# EAGLE schematic triple8_2 (EAGLE 5.06)
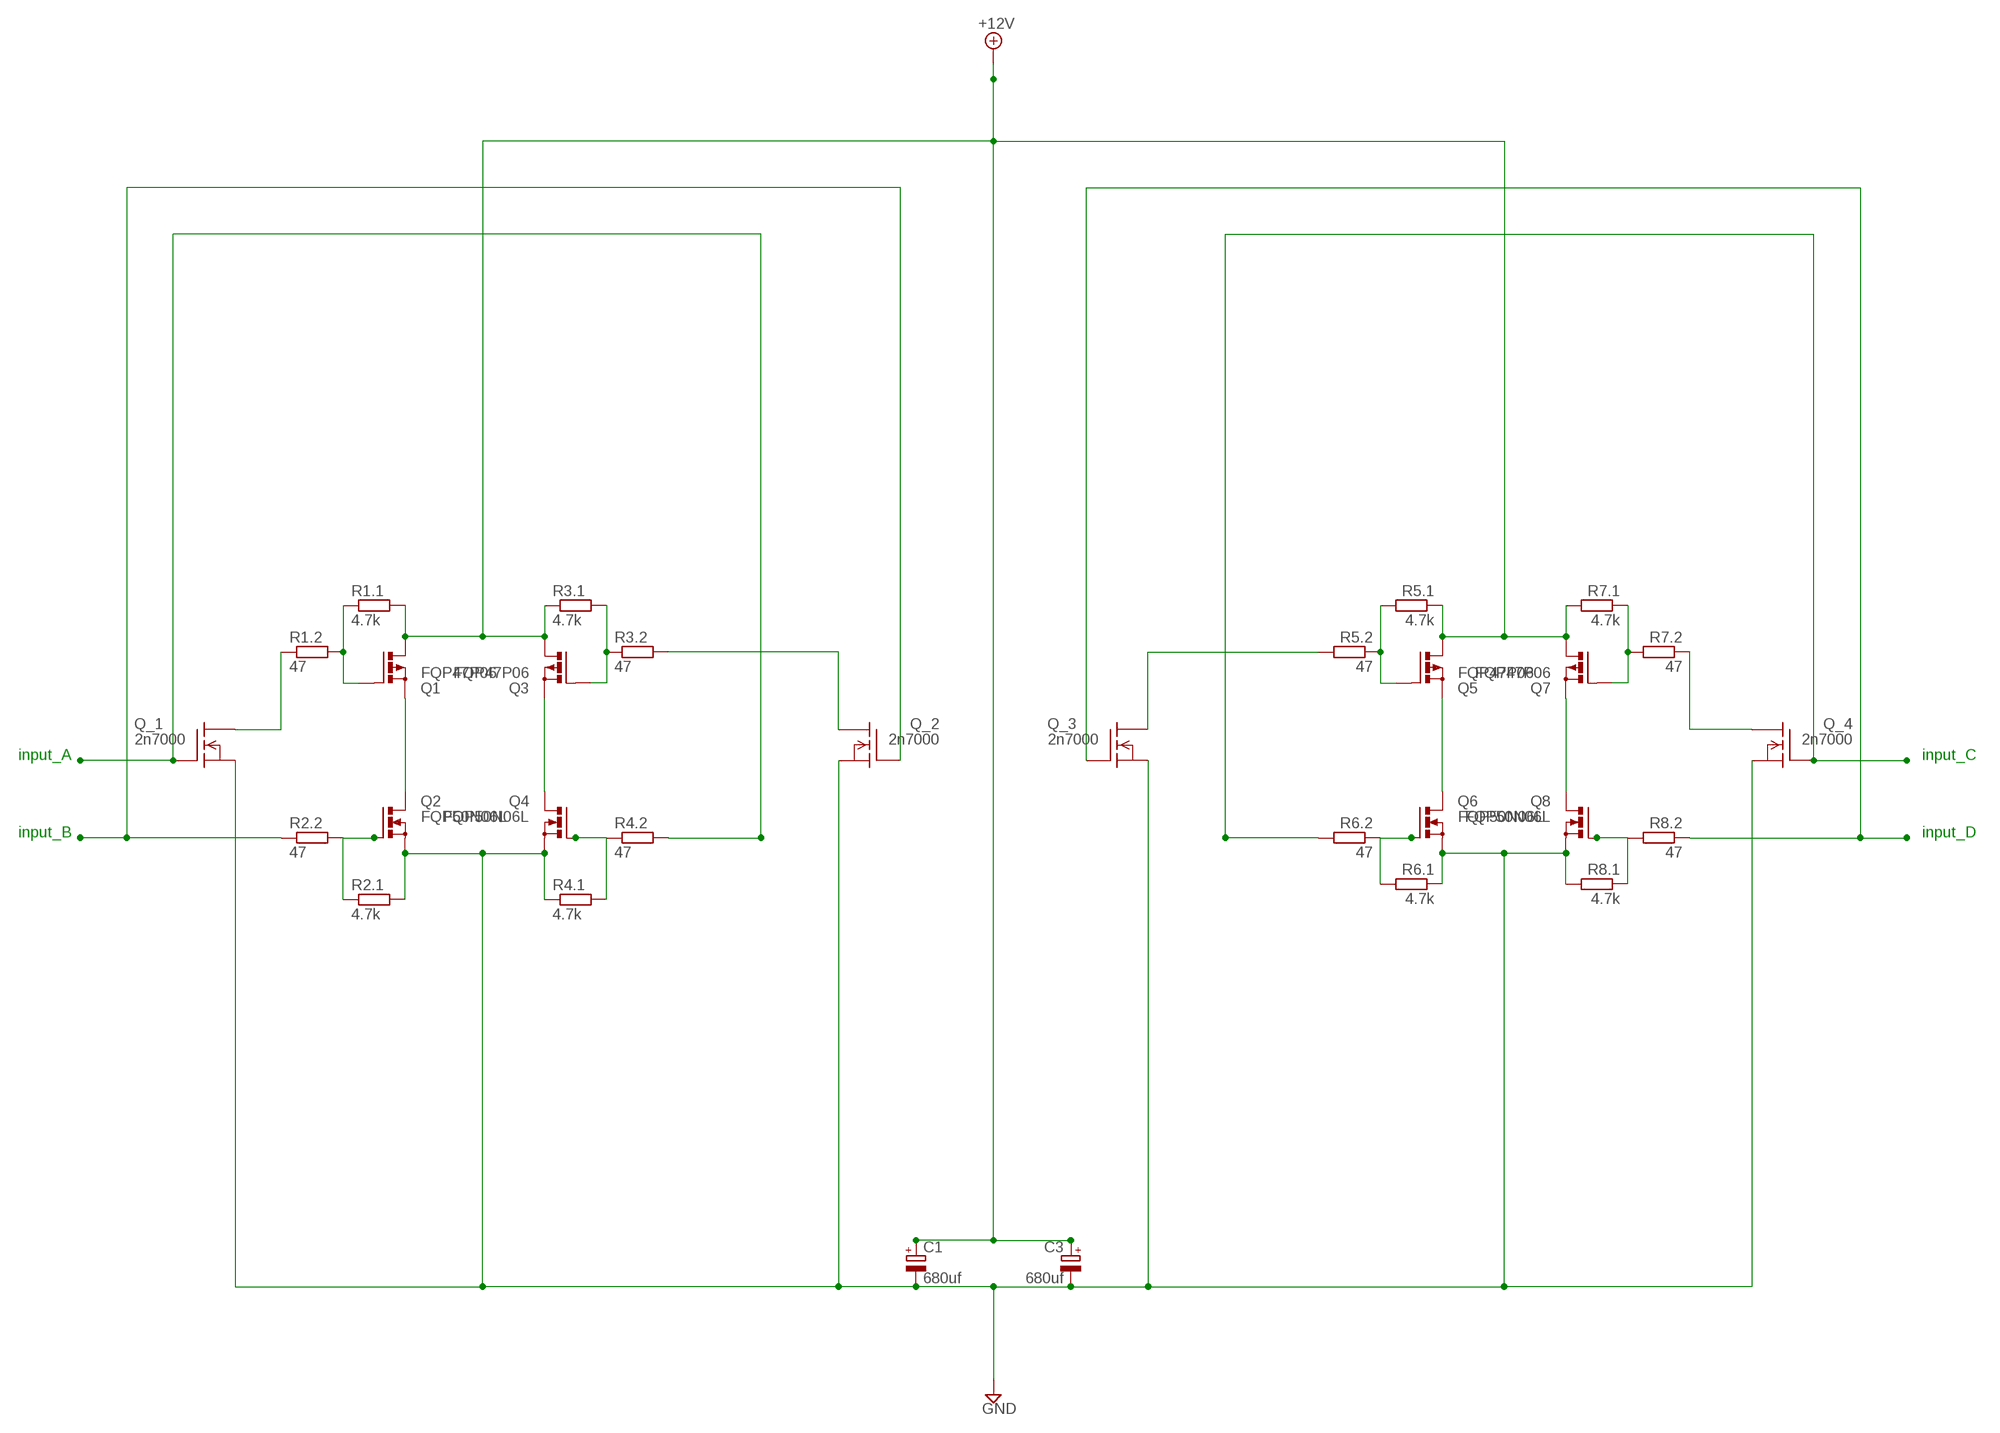
[diagram p0: schematic, sheet 1]

## Parts
C1  680uf  CPOL-EUE5-13  [E5-13]
C3  680uf  CPOL-EUE5-13  [E5-13]
Q1  FQP47P06  PMOSFET_PTO220BV  [TO220BV]
Q2  FQP50N06L  PMOSFET_NTO220BV  [TO220BV]
Q3  FQP47P06  PMOSFET_PTO220BV  [TO220BV]
Q4  FQP50N06L  PMOSFET_NTO220BV  [TO220BV]
Q5  FQP47P06  PMOSFET_PTO220BV  [TO220BV]
Q6  FQP50N06L  PMOSFET_NTO220BV  [TO220BV]
Q7  FQP47P06  PMOSFET_PTO220BV  [TO220BV]
Q8  FQP50N06L  PMOSFET_NTO220BV  [TO220BV]
Q_1  2n7000  BSS101  [TO92]
Q_2  2n7000  BSS101  [TO92]
Q_3  2n7000  BSS101  [TO92]
Q_4  2n7000  BSS101  [TO92]
R1.1  4.7k  R-EU_0204/5  [0204/5]
R1.2  47  R-EU_0204/5  [0204/5]
R2.1  4.7k  R-EU_0204/5  [0204/5]
R2.2  47  R-EU_0204/5  [0204/5]
R3.1  4.7k  R-EU_0204/5  [0204/5]
R3.2  47  R-EU_0204/5  [0204/5]
R4.1  4.7k  R-EU_0204/5  [0204/5]
R4.2  47  R-EU_0204/5  [0204/5]
R5.1  4.7k  R-EU_0204/5  [0204/5]
R5.2  47  R-EU_0204/5  [0204/5]
R6.1  4.7k  R-EU_0204/5  [0204/5]
R6.2  47  R-EU_0204/5  [0204/5]
R7.1  4.7k  R-EU_0204/5  [0204/5]
R7.2  47  R-EU_0204/5  [0204/5]
R8.1  4.7k  R-EU_0204/5  [0204/5]
R8.2  47  R-EU_0204/5  [0204/5]

## Nets
+12V: C1.+ C3.+ Q1.D Q3.D Q5.D Q7.D R1.1.2 R3.1.1 R5.1.1 R7.1.2
GND: C1.- C3.- Q2.S Q4.S Q6.S Q8.S Q_1.1(S) Q_2.1(S) Q_3.1(S) Q_4.1(S) R2.1.2 R4.1.1 R6.1.1 R8.1.2
IN1: Q_3.2(G) R8.2.1
IN3: Q_4.2(G) R6.2.2
IN5: Q_1.2(G) R4.2.2
INB: Q_2.2(G) R2.2.1
N$1: Q3.S Q4.D
N$2: Q5.G R5.1.2 R5.2.1
N$3: Q2.G R2.1.1 R2.2.2
N$4: Q4.G R4.1.2 R4.2.1
N$5: Q7.G R7.1.1 R7.2.2
N$6: Q5.S Q6.D
N$7: Q8.G R8.1.1 R8.2.2
N$8: Q_1.3(D) R1.2.1
N$9: Q6.G R6.1.2 R6.2.1
N$10: Q1.G R1.1.1 R1.2.2
N$11: Q3.G R3.1.2 R3.2.1
N$14: Q_4.3(D) R7.2.1
N$17: Q_3.3(D) R5.2.2
N$21: Q1.S Q2.D
N$26: Q7.S Q8.D
N$29: Q_2.3(D) R3.2.2

## Notes on the sheet
- input_A | input_C
- input_B | input_D

## Library data of the parts
C1 C3 = rcl:CPOL-EU: POLARIZED CAPACITOR, European symbol
Q1 Q3 Q5 Q7 = transistor-power:PMOSFET_P: Power MOSFET P-Channel
Q2 Q4 Q6 Q8 = transistor-power:PMOSFET_N: Power MOSFET N-Channel
Q_1-Q_4 = transistor-fet:BSS101: N-Channel Enhancement MOSFET 200V; 0,16A; 11Ohm
R1.1 R1.2 R2.1 R2.2 R3.1 R3.2 R4.1 R4.2 R5.1 R5.2 R6.1 R6.2 R7.1 R7.2 R8.1 R8.2 = rcl:R-EU_: RESISTOR, European symbol